# EAGLE design led-board (EAGLE 7.2.0)
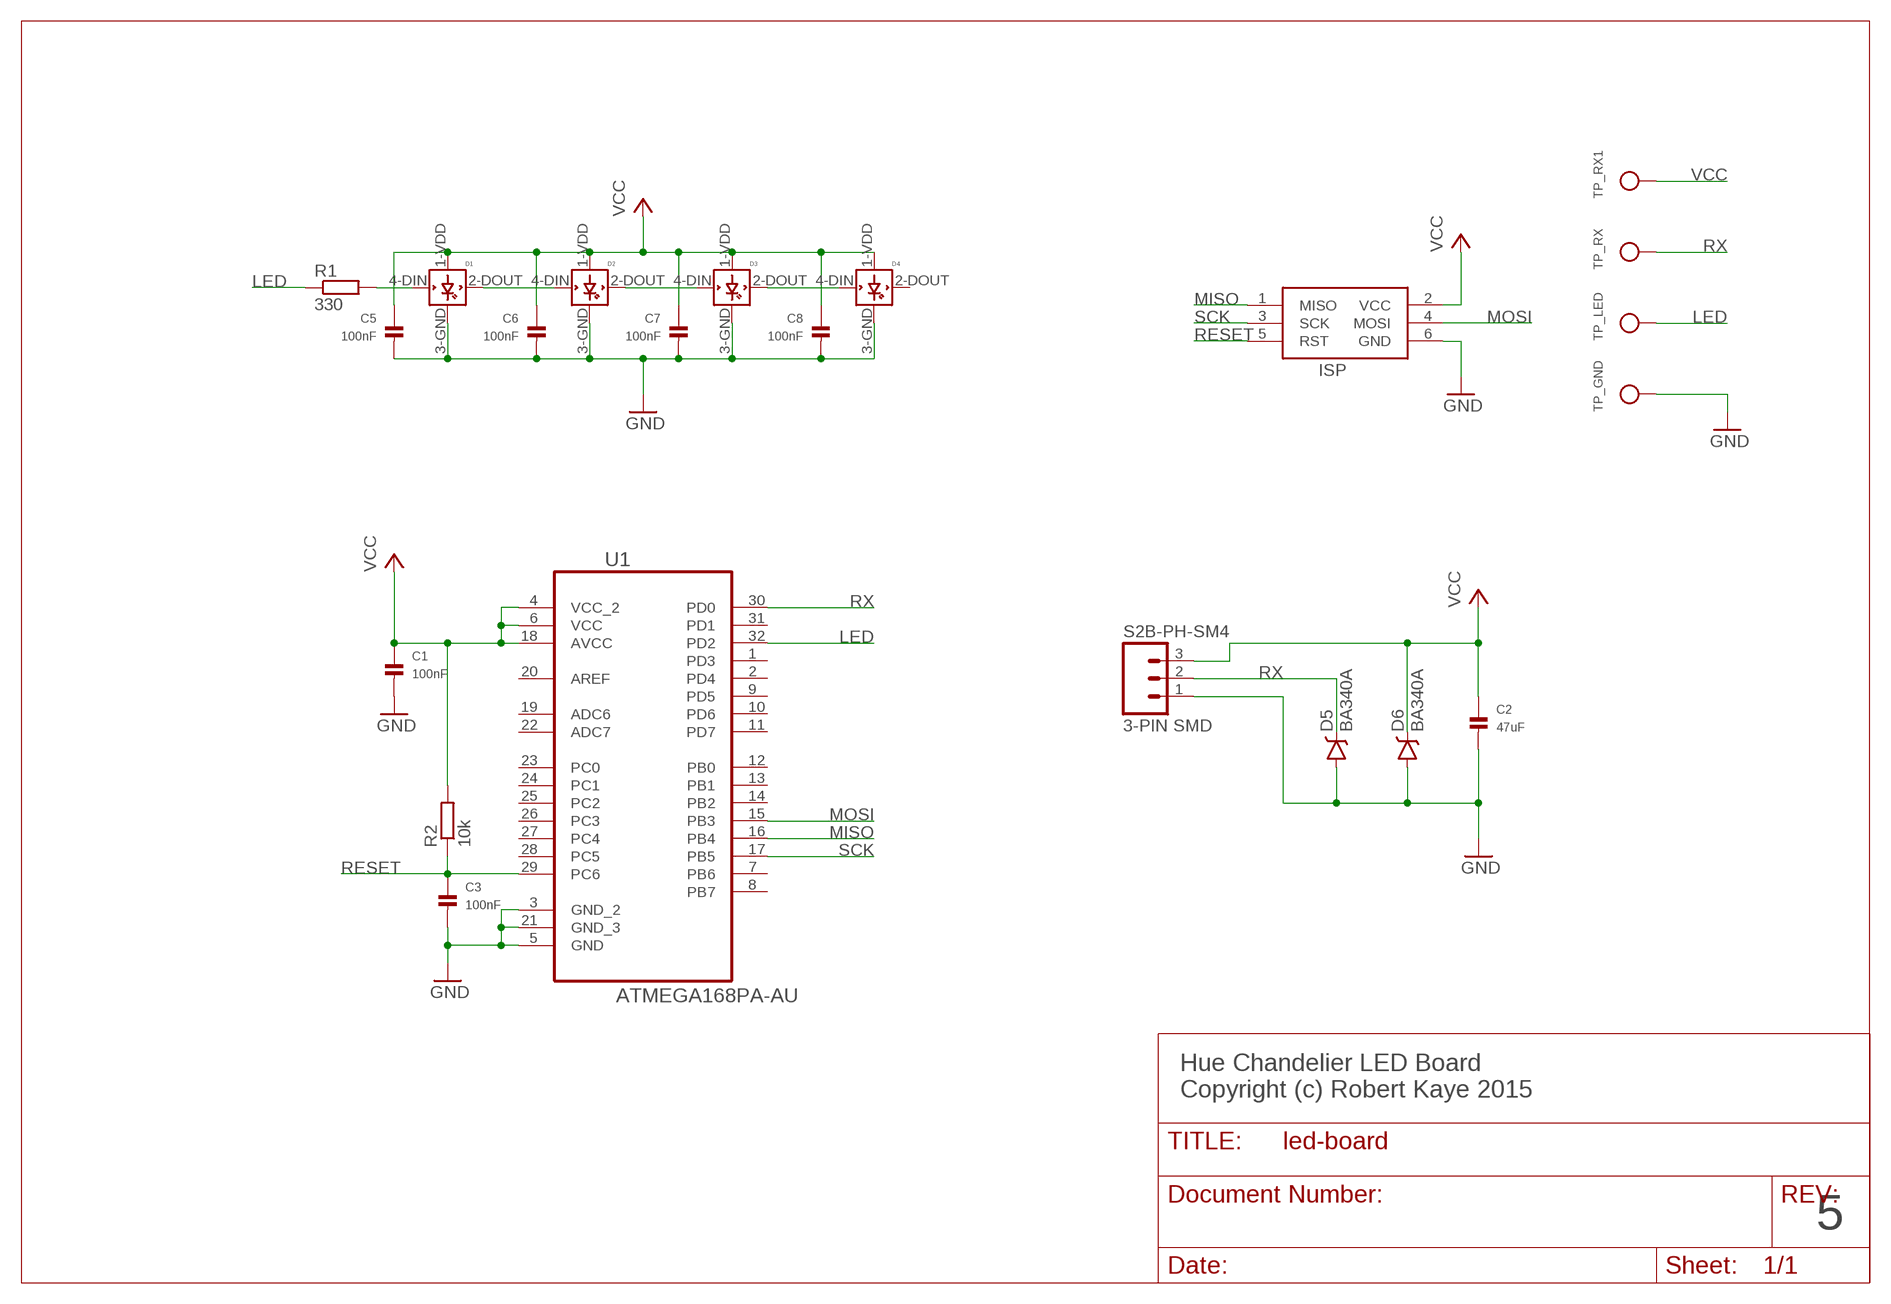
[diagram p0: schematic, sheet 1]

## Parts
C1  100nF  CAP_CERAMIC0805  [0805]
C2  47uF  CAP_CERAMIC1206  [1206]
C3  100nF  CAP_CERAMIC0805  [0805]
C5  100nF  CAP_CERAMIC0805  [0805]
C6  100nF  CAP_CERAMIC0805  [0805]
C7  100nF  CAP_CERAMIC0805  [0805]
C8  100nF  CAP_CERAMIC0805  [0805]
D1  WS2812B  [WS2812B]
D2  WS2812B  [WS2812B]
D3  WS2812B  [WS2812B]
D4  WS2812B  [WS2812B]
D5  BA340A  B340A  [SMA-DIODE]
D6  BA340A  B340A  [SMA-DIODE]
ISP  AVRISP-6  [AVRISP]
R1  330  R-EU_R0805  [R0805]
R2  10k  R-EU_R0805  [R0805]
S2B-PH-SM4  3-PIN SMD  M03JST-SMD  [JST-3-SMD]
TP_GND  TESTPOINT1.5X2.0MM_NOCREAM  [PAD-1.5X2.0]
TP_LED  TESTPOINT1.5X2.0MM_NOCREAM  [PAD-1.5X2.0]
TP_RX  TESTPOINT1.5X2.0MM_NOCREAM  [PAD-1.5X2.0]
TP_RX1  TESTPOINT1.5X2.0MM_NOCREAM  [PAD-1.5X2.0]
U1  ATMEGA168PA-AU  [QFP80P900X900X120-32N]

## Nets
D3: D2.2-DOUT(DOUT) D3.4-DIN(DIN)
GND: C1.2 C2.2 C3.2 C5.2 C6.2 C7.2 C8.2 D1.3-GND(GND) D2.3-GND(GND) D3.3-GND(GND) D4.3-GND(GND) D5.A D6.A ISP.6(GND) S2B-PH-SM4.1 TP_GND.P$1 U1.3(GND_2) U1.5(GND) U1.21(GND_3)
LED: R1.1 TP_LED.P$1 U1.32(PD2)
MISO: ISP.1(MISO) U1.16(PB4)
MOSI: ISP.4(MOSI) U1.15(PB3)
N$1: D3.2-DOUT(DOUT) D4.4-DIN(DIN)
N$2: D1.2-DOUT(DOUT) D2.4-DIN(DIN)
N$8: D1.4-DIN(DIN) R1.2
RESET: C3.1 ISP.5(RST) R2.1 U1.29(PC6)
RX: D5.C S2B-PH-SM4.2 TP_RX.P$1 U1.30(PD0)
SCK: ISP.3(SCK) U1.17(PB5)
VCC: C1.1 C2.1 C5.1 C6.1 C7.1 C8.1 D1.1-VDD(VDD) D2.1-VDD(VDD) D3.1-VDD(VDD) D4.1-VDD(VDD) D6.C ISP.2(VCC) R2.2 S2B-PH-SM4.3 TP_RX1.P$1 U1.4(VCC_2) U1.6(VCC) U1.18(AVCC)
Unconnected: D4.2-DOUT(DOUT) U1.1(PD3) U1.2(PD4) U1.7(PB6) U1.8(PB7) U1.9(PD5) U1.10(PD6) U1.11(PD7) U1.12(PB0) U1.13(PB1) U1.14(PB2) U1.19(ADC6) U1.20(AREF) U1.22(ADC7) U1.23(PC0) U1.24(PC1) U1.25(PC2) U1.26(PC3) U1.27(PC4) U1.28(PC5) U1.31(PD1)

## Notes on the sheet
- Hue Chandelier LED Board
  Copyright (c) Robert Kaye 2015
- 5

## Library data of the parts
C1 C3 C5-C8 = microbuilder:CAP_CERAMIC: Ceramic Capacitors 0402 - 0402 Surface Mount Capacitors 16pF 50V 5% [Digikey: 445-4899-2-ND] 18pF 50V 5% [Digikey: 490-1281-2-ND] 22pF 50V 5% [Digikey: 490-1283-2-ND] 68pF 50V 5% [Digikey: 490-1289-2-ND] 0.1uF 10V 10% [Digikey: 490-1318-2-ND] 1.0uF 6.3V 10% [Digikey: 490-1320-2-ND] 0603 - 0603 Surface Mount Capacitors 16 pF 50V 5% [Digikey: 445-5051-2-ND] 22 pF 50V [Digikey: PCC220ACVTR-ND] 33 pF 50V 5% [Digikey: 490-1415-1-ND] 56pF 50V 5% [Digikey: 490-1421-1-ND] 220pF 50V 5% [Digikey: 445-1285-1-ND] 680 pF 50V 2200 pF 50V 5% C0G [Digikey: 445-1297-1-ND] 5600 pF 100V 5% X7R [Digikey: 478-3711-1-ND] 0.1 µF 25V 10% [Digikey: PCC2277TR-ND] 0.22 µF 16V 10% X7R [Digikey: 445-1318-1-ND] 1.0 µF 25V 10% [Digikey: 445-5146-2-ND] 0603 - RF Specific 3pF 250V +/-0.1pF RF [Digikey: 712-1347-1-ND] 18 pF 250V 5% [Digikey: 478-3505-1-ND or 712-1322-1-ND] 56 pF 250V 5% C0G RF [Digikey: 490-4867-1-ND] 68 pF 250V RF [Digikey: 490-4868-1-ND] 0805 - 0805 Surface Mount Capacitors 220 pF 250V 2% RF Ceramic Capacitor [Digikey: 712-1398-1-ND] 1000 pF 50V 2% NP0 Ceramic Capacitor [Digikey: 478-3760-1-ND] 0.1 µF 25V 10% Ceramic Capacitor [Digikey: PCC1828TR-ND] 1.0 µF 16V 10% Ceramic Capacitor[Digikey: 490-1691-2-ND] 10.0 µF 10V 10% Ceramic Capacitor[Digikey: 709-1228-1-ND] 10.0 uF 16V 10% Ceramic Capacitor [Digikey: 478-5165-2-ND] 47 uF 6.3V 20% Ceramic Capacitor [Digikey: 587-1779-1-ND or 399-5506-1-ND] 1206 - 1206 Surface Mount Capacitors 47uF 10V 20% Ceramic Capacitor [Digikey: 490-5528-1-ND or 399-5508-1-ND or 445-6010-1-ND] 100uF 6.3V -20%, +80% Y5V Ceramic Capacitor (Digikey: 490-4512-1-ND, Mouser: 81-GRM31CF50J107ZE1L); MPN: MCSH21B104K250CT; OC_NEWARK: 23T7445
C2 = microbuilder:CAP_CERAMIC: Ceramic Capacitors 0402 - 0402 Surface Mount Capacitors 16pF 50V 5% [Digikey: 445-4899-2-ND] 18pF 50V 5% [Digikey: 490-1281-2-ND] 22pF 50V 5% [Digikey: 490-1283-2-ND] 68pF 50V 5% [Digikey: 490-1289-2-ND] 0.1uF 10V 10% [Digikey: 490-1318-2-ND] 1.0uF 6.3V 10% [Digikey: 490-1320-2-ND] 0603 - 0603 Surface Mount Capacitors 16 pF 50V 5% [Digikey: 445-5051-2-ND] 22 pF 50V [Digikey: PCC220ACVTR-ND] 33 pF 50V 5% [Digikey: 490-1415-1-ND] 56pF 50V 5% [Digikey: 490-1421-1-ND] 220pF 50V 5% [Digikey: 445-1285-1-ND] 680 pF 50V 2200 pF 50V 5% C0G [Digikey: 445-1297-1-ND] 5600 pF 100V 5% X7R [Digikey: 478-3711-1-ND] 0.1 µF 25V 10% [Digikey: PCC2277TR-ND] 0.22 µF 16V 10% X7R [Digikey: 445-1318-1-ND] 1.0 µF 25V 10% [Digikey: 445-5146-2-ND] 0603 - RF Specific 3pF 250V +/-0.1pF RF [Digikey: 712-1347-1-ND] 18 pF 250V 5% [Digikey: 478-3505-1-ND or 712-1322-1-ND] 56 pF 250V 5% C0G RF [Digikey: 490-4867-1-ND] 68 pF 250V RF [Digikey: 490-4868-1-ND] 0805 - 0805 Surface Mount Capacitors 220 pF 250V 2% RF Ceramic Capacitor [Digikey: 712-1398-1-ND] 1000 pF 50V 2% NP0 Ceramic Capacitor [Digikey: 478-3760-1-ND] 0.1 µF 25V 10% Ceramic Capacitor [Digikey: PCC1828TR-ND] 1.0 µF 16V 10% Ceramic Capacitor[Digikey: 490-1691-2-ND] 10.0 µF 10V 10% Ceramic Capacitor[Digikey: 709-1228-1-ND] 10.0 uF 16V 10% Ceramic Capacitor [Digikey: 478-5165-2-ND] 47 uF 6.3V 20% Ceramic Capacitor [Digikey: 587-1779-1-ND or 399-5506-1-ND] 1206 - 1206 Surface Mount Capacitors 47uF 10V 20% Ceramic Capacitor [Digikey: 490-5528-1-ND or 399-5508-1-ND or 445-6010-1-ND] 100uF 6.3V -20%, +80% Y5V Ceramic Capacitor (Digikey: 490-4512-1-ND, Mouser: 81-GRM31CF50J107ZE1L); MPN: CC0805KKX7R7BB105; OC_NEWARK: 68R4880
D1-D4 = adafruit:WS2812B; MPN: WS2812B; OC_NEWARK: 43Y4720
D5 D6 = SparkFun-DiscreteSemi:B340A: Schottky Diode 3A-40V; MPN: B330A-13-F; OC_NEWARK: 12T1463; PROD_ID: DIO-09886
ISP = adafruit:AVRISP: AVR ISP HEADER Standard 6 pin header for AVR programming; OC_NEWARK: unknown
R1 = resistor:R-EU_: RESISTOR, European symbol; MPN: RC0805JR-07330RL; OC_NEWARK: 66R3661
R2 = resistor:R-EU_: RESISTOR, European symbol; MPN: RT0805FRE0710KL; OC_NEWARK: 62M2341
S2B-PH-SM4 = SparkFun-Connectors:M03: Header 3 Standard 3-pin 0.1" header. Use with straight break away headers (SKU : PRT-00116), right angle break away headers (PRT-00553), swiss pins (PRT-00743), machine pins (PRT-00117), and female headers (PRT-00115). Molex polarized connector foot print use with SKU : PRT-08232 with associated crimp pins and housings.; MF: FARNELL; MPN: S3B-PH-SM4-TB(LF)(SN); OC_NEWARK: 38K8071; PROD_ID: CONN-12591
TP_GND TP_LED TP_RX TP_RX1 = microbuilder:TESTPOINT: Test Point Various test points for characterisation and PCB testing TESTPOINT_SMT - Compact Surface Mount Test Point [Digikey: 5016KTR-ND]; OC_NEWARK: unknown
U1 = Atmel_By_element14_Batch_1-00:ATMEGA168PA-AU: 8-bit Microcontroller; MPN: ATMEGA168PA-AU; OC_FARNELL: 1748516; OC_NEWARK: 68T2717; PACKAGE: TQFP-32; SUPPLIER: Atmel

## Net classes
0 default: width 0.279 mm, drill 0.508 mm, clearance 0.229 mm

## Board
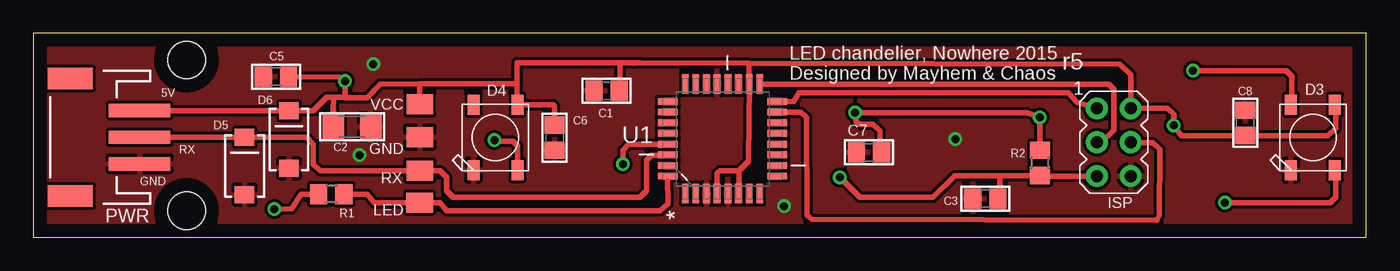
[diagram p1: board, top side]
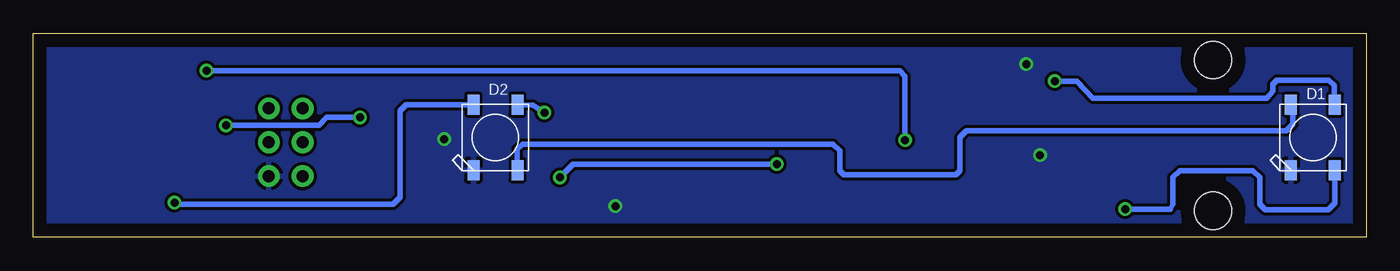
[diagram p2: board, bottom side, seen from below]

Size 100 x 15.3 mm. Coordinates in mm from the lower left corner, seen from the top.
Outline: 0,0 100,0 100,15.3 0,15.3 0,0
Copper layers (1*16): Top 0.035mm / dielectric 1.5mm / Bottom 0.035mm
Design rules "default *": minimum track width 10mil, minimum drill 20mil, track to track 8mil, track to pad 8mil, pad to pad 8mil, via to via 8mil, smd to smd 8mil, copper to edge 40mil, drill to drill 8mil, minimum pad ring 10mil, minimum via ring 8mil, stop-mask expansion 4mil, vias tented up to drill 0mil, thermal gap 10mil
Holes 2.8 mm at 11.5,13.3 11.5,2

### Footprints (pad centres in the part's own frame; a part is rotated, then mirrored left to right if it is on the bottom)
0805 = smd 1.3 x 1.5: 1 -0.95,0; 2 0.95,0
1206 = smd 1.6 x 1.8: 1 -1.4,0; 2 1.4,0
WS2812B = smd 1.5 x 0.9: 1-VDD 2.45,-1.65; 2-DOUT 2.45,1.65; 3-GND -2.45,1.65; 4-DIN -2.45,-1.65
SMA-DIODE = smd 1.27 x 1.47: A -2.15,0; C 2.15,0
AVRISP = drill 0.9 pad 1.626: 1 -1.27,2.54; 2 1.27,2.54; 3 -1.27,0; 4 1.27,0; 5 -1.27,-2.54; 6 1.27,-2.54
R0805 = smd 1.3 x 1.5: 1 -0.95,0; 2 0.95,0
JST-3-SMD = smd 1 x 4.6: 1 -1.99,-4.77; 2 0.01,-4.77; 3 2.01,-4.77 | smd 1.6 x 3.4: NC1 -4.39,0.43; NC2 4.41,0.43
PAD-1.5X2.0 = smd 1.5 x 2: P$1 0,0
QFP80P900X900X120-32N = smd 1.473 x 0.508: 1 -4.115,2.794; 2 -4.115,2.007; 3 -4.115,1.194; 4 -4.115,0.406; 5 -4.115,-0.406; 6 -4.115,-1.194; 7 -4.115,-2.007; 8 -4.115,-2.794; 17 4.115,-2.794; 18 4.115,-2.007; 19 4.115,-1.194; 20 4.115,-0.406; 21 4.115,0.406; 22 4.115,1.194; 23 4.115,2.007; 24 4.115,2.794 | smd 0.508 x 1.473: 9 -2.794,-4.115; 10 -2.007,-4.115; 11 -1.194,-4.115; 12 -0.406,-4.115; 13 0.406,-4.115; 14 1.194,-4.115; 15 2.007,-4.115; 16 2.794,-4.115; 25 2.794,4.115; 26 2.007,4.115; 27 1.194,4.115; 28 0.406,4.115; 29 -0.406,4.115; 30 -1.194,4.115; 31 -2.007,4.115; 32 -2.794,4.115

### Placement (x,y rotation side)
C1  43.02,10.98 180 top
C2  23.92,8.29 0 top
C3  71.42,2.9 180 top
C5  18.2,12.05 180 top
C6  39.12,7.48 270 top
C7  62.71,6.38 180 top
C8  90.92,8.58 90 top
D1  4,7.5 90 bottom
D2  65.33,7.5 90 bottom
D3  96,7.5 90 top
D4  34.67,7.5 90 top
D5  15.85,5.35 90 top
D6  19.18,7.33 90 top
ISP  81.06,7.13 0 top
R1  22.35,3.25 180 top
R2  75.53,5.58 90 top
S2B-PH-SM4  3.2,7.5 90 top
TP_GND  29,7.52 90 top
TP_LED  28.98,2.6 270 top
TP_RX  29,5 90 top
TP_RX1  29,10 90 top
U1  51.71,7.39 90 top

### Tracks (layer width: path | path; a pad name or v marks a point on that pad's centre or on a via)
D3  (via drill 0.6)
  Top 0.406: v89.4,2.6 97.3,2.6 97.7,3 97.7,5 D3.4-DIN
  Bottom 0.406: D2.2-DOUT 72.05,9.95 72.5,9.5 72.5,3 73,2.5 89.3,2.5 v89.4,2.6
GND  (via drill 0.6)
  other vias: 24.48,6.17 56.33,2.35 25.5,13 69.17,7.38
  pour Top: -0.5,16 -0.5,-0.5 100.5,-0.5 100.5,16
  pour Bottom: -1,16.5 -1,-1 101,-1 101,16.5
LED
  Top 0.406: R1.1 25.05,3.23 25.55,2.6 TP_LED.P$1 30.5,2.6 31,2 47,2 47.6,2.52 U1.32
MISO
  Top 0.406: ISP.1 78.3,10.15 77.65,10.85 57.45,10.85 57.08,10.22 U1.16
MOSI
  Top 0.406: U1.15 57.6,9.4 58,9 58.05,1.65 58.42,1.35 84.28,1.27 84.47,1.68 84.5,6.6 84,7.1 82.36,7.1 ISP.4
N$1  (via drill 0.6)
  Top 0.406: D4.4-DIN 36.32,6.88 36,7.2 34.7,7.2 v34.6,7.3 | 94.3,10 D3.2-DOUT 94.4,10 94.4,12.1 94,12.5 v87,12.5
  Bottom 0.406: v87,12.5 35,12.5 34.6,12.1 v34.6,7.3
N$2
  Bottom 0.406: D2.4-DIN 63.7,5.07 63.7,6.6 63.3,7 40,7 39.5,6.5 39.5,5 39.2,4.7 30.8,4.7 30.5,5 30.5,7.5 30,8 6,8 5.5,8.5 5.5,9.8 D1.2-DOUT
N$8  (via drill 0.6)
  Top 0.406: v18.07,2.12 19.38,2.15 20.1,3.23 R1.2
  Bottom 0.406: D1.4-DIN 2.35,2.58 2.85,2.08 7.58,2.08 8,2.5 8,4.5 8.5,5 14,5 14.5,4.5 14.5,2.48 14.7,2.12 v18.07,2.12
RESET  (via drill 0.6)
  Top 0.406: 47.56,6.95 U1.29 | 72.4,2.88 C3.1 72.4,2.9 72.5,3 72.5,4.63 | v60.5,4.5 62,3 67.5,3 69.14,4.63 72.5,4.63 | 47.61,7 U1.29 | ISP.5 75.58,4.59 R2.1 72.5,4.63 | v44.23,5.5 44.23,6.55 44.65,6.97 47.59,6.97 U1.29
  Bottom 0.406: v60.5,4.5 59.5,5.5 v44.23,5.5
RX
  Top 0.406: U1.30 47.55,6.15 46.38,6.15 46,5.78 46,3.5 45.5,3 31.5,3 31,3.5 31,4.5 30.5,5 TP_RX.P$1 21.5,5 21,5.5 21,7 20.49,7.51 20.48,7.5 D5.C 8.28,7.5 S2B-PH-SM4.2
SCK
  Top 0.406: ISP.3 80.13,7.13 81.05,8.05 81.05,11.12 80.67,11.5 U1.17
VCC  (via drill 0.6)
  Top 0.406: 44,13.08 36.3,13.1 36.31,11.5 | 44,13.08 45,13.08 | 45,13.08 45.5,13.08 53.7,13.06 | 53.7,13.06 81.5,13 82.35,12.2 82.35,9.69 | 36.31,11.5 D4.1-VDD 39,9.95 39.12,9.83 C6.1 | C8.1 97.13,7.63 97.7,8.2 97.7,9.9 D3.1-VDD | S2B-PH-SM4.3 12,9.5 D6.C 21,9.5 22,10.5 22.52,10.5 | 45.02,13.06 45,13.08 | 53.7,13.06 U1.18 53.65,5.9 53.65,5.7 52.95,5 | 52.95,5 52.95,3.32 U1.6 | U1.4 51.3,4.8 51.5,5 52.95,5 | TP_RX1.P$1 29,11.5 | 90.79,7.5 C8.1 | 82.35,9.69 ISP.2 | C1.1 44,13.08 | 22.52,10.5 23.43,10.5 23.4,10.47 | 23.4,10.47 25.02,10.47 26,11.5 29,11.5 | 29,11.5 36.31,11.5 | 23.4,10.47 v23.38,11.72 22.93,12.03 C5.1 | R2.2 v75.5,9 74.55,9.35 v61.65,9.35 61.7,8.68 62,8.5 63,8.5 63.5,8 63.5,6.38 C7.1 | C8.1 86.12,7.62 v85.55,8.4 85.55,9.22 85.08,9.7 82.35,9.69 | C2.1 22.52,9.48 22.5,9.5 22.52,10.5
  Bottom 0.406: D1.1-VDD 2.4,10 2.4,11.4 2.8,11.8 6.7,11.8 7,11.5 7,10.97 7.45,10.43 20.5,10.43 21.7,11.72 v23.38,11.72 | v75.5,9 78,9 78.55,8.4 v85.55,8.4 | v61.65,9.35 62.52,9.93 D2.1-VDD

### Text on the board
tNames: r5 | LED chandelier, Nowhere 2015 / Designed by Mayhem & Chaos | 5V | VCC | RX | GND | GND | RX | LED | PWR